# Altium schematic sheet BRD9057A_SiWx917M_4-Layer_ExtSw_REF_DES_A01_Page_3.SchDoc: =TitlePage3
size A3; Organization: Altium Limited; Address1: L3, 12a Rodborough Rd; Address2: Frenchs Forest; Address3: NSW; Address4: Australia 2086; SheetNumber: 3; SheetTotal: 5
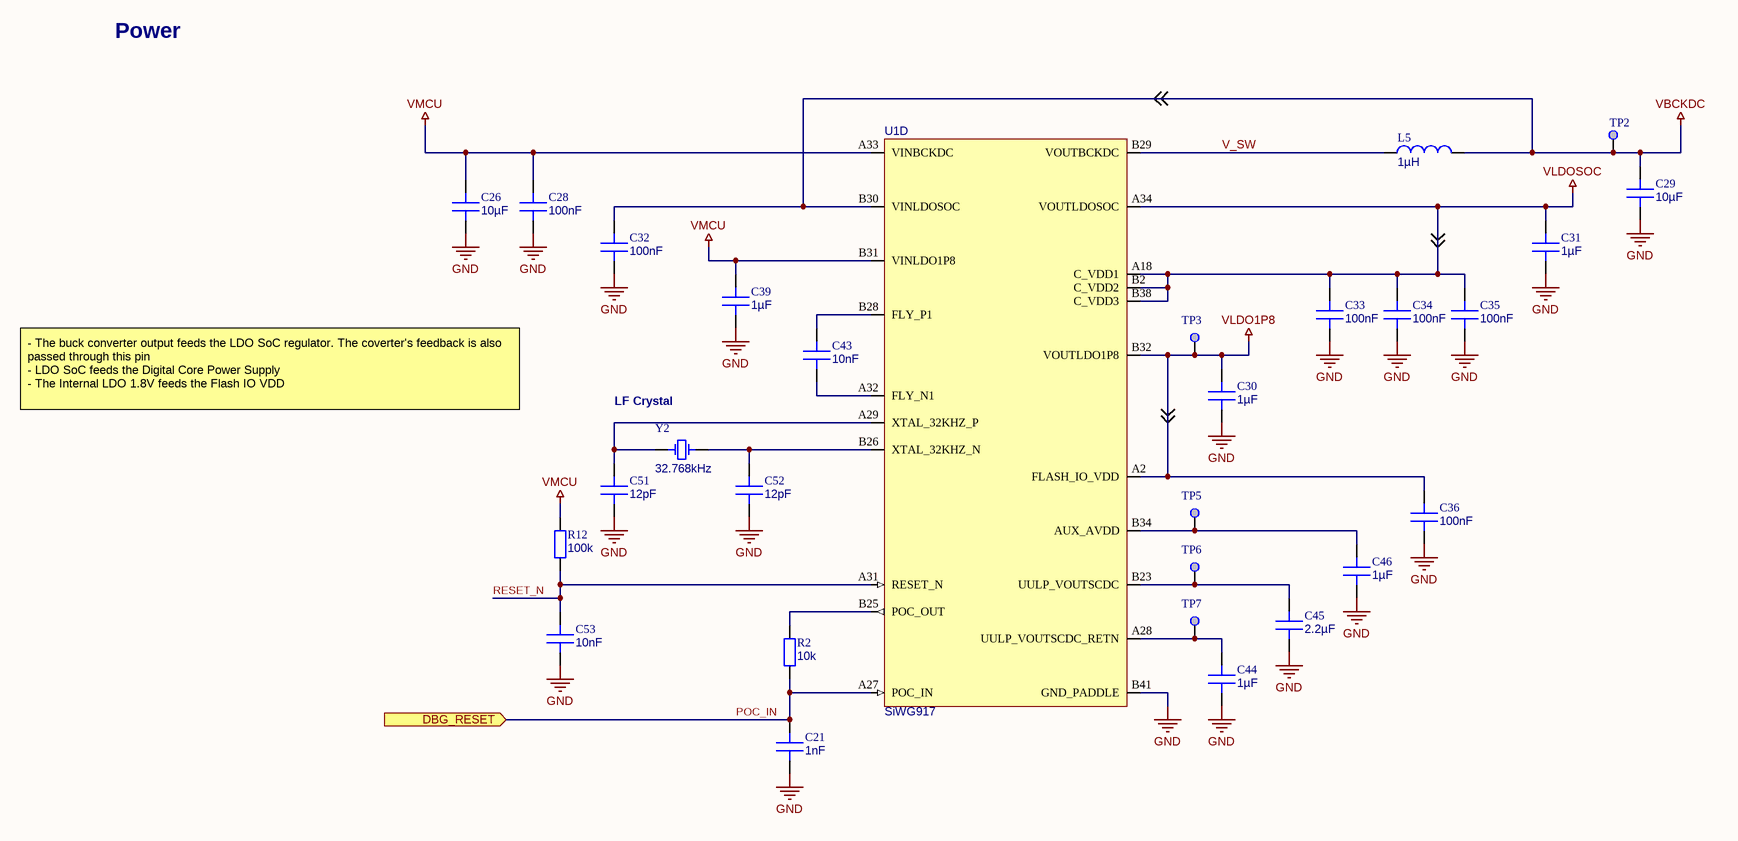
[diagram p0: BRD9057A_SiWx917M_4-Layer_ExtSw_REF_DES_A01_Page_3.SchDoc]

## Parts
C21  value 1nF  [C0201_GM]  (hidden comment: CAP CER 0201 X5R 1nF 16V 10%)
C26  value 10µF  [C0603]  (hidden comment: CAP CER 0603 X5R 10uF 16V 10%)
C28  value 100nF  [C0201_GM]  (hidden comment: CAP CER 0201 X5R 100nF 16V 10%)
C29  value 10µF  [C0603]  (hidden comment: CAP CER 0603 X5R 10uF 16V 10%)
C30  value 1µF  [C0201_GM]  (hidden comment: CAP CER 0201 X5R 1uF 16V 20%)
C31  value 1µF  [C0201_GM]  (hidden comment: CAP CER 0201 X5R 1uF 16V 20%)
C32  value 100nF  [C0201_GM]  (hidden comment: CAP CER 0201 X5R 100nF 16V 10%)
C33  value 100nF  [C0201_GM]  (hidden comment: CAP CER 0201 X5R 100nF 16V 10%)
C34  value 100nF  [C0201_GM]  (hidden comment: CAP CER 0201 X5R 100nF 16V 10%)
C35  value 100nF  [C0201_GM]  (hidden comment: CAP CER 0201 X5R 100nF 16V 10%)
C36  value 100nF  [C0201_GM]  (hidden comment: CAP CER 0201 X5R 100nF 16V 10%)
C39  value 1µF  [C0201_GM]  (hidden comment: CAP CER 0201 X5R 1uF 16V 20%)
C43  value 10nF  [C0201_GM]  (hidden comment: CAP CER 0201 X5R 10nF 16V 10%)
C44  value 1µF  [C0201_GM]  (hidden comment: CAP CER 0201 X5R 1uF 16V 20%)
C45  value 2.2µF  [C0201_GM]  (hidden comment: CAP CER 0201 X5R 2.2uF 10V 20%)
C46  value 1µF  [C0201_GM]  (hidden comment: CAP CER 0201 X5R 1uF 16V 20%)
C51  value 12pF  [C0201_GM]  (hidden comment: GRM0335C1H120FA01)
C52  value 12pF  [C0201_GM]  (hidden comment: GRM0335C1H120FA01)
C53  value 10nF  [C0201_GM]  (hidden comment: CAP CER 0201 X5R 10nF 16V 10%)
L5  value 1µH  [INDC2012X100N_DFE]  (hidden comment: DFE201210U-1R0M#)
R2  value 10k  [R0201]  (hidden comment: RES 0201 10K 1/20W 1% 200ppm)
R12  value 100k  [R0201]  (hidden comment: RES 0201 100K 1/20W 1% 200ppm)
TP2  TEST POINT SMD 1MM  [TP_1.0_SMD]  (value not drawn)  (no BOM)
TP3  TEST POINT SMD 1MM  [TP_1.0_SMD]  (value not drawn)  (no BOM)
TP5  TEST POINT SMD 1MM  [TP_1.0_SMD]  (value not drawn)  (no BOM)
TP6  TEST POINT SMD 1MM  [TP_1.0_SMD]  (value not drawn)  (no BOM)
TP7  TEST POINT SMD 1MM  [TP_1.0_SMD]  (value not drawn)  (no BOM)
U1  value SiWG917  [QFN84_SI_SiWx917_A1]  (hidden comment: SiWG917M111MGTBAR)  (part D of 4)
Y2  value 32.768kHz  [XTAL200X120X60-2N]  (hidden comment: CM8V-T1A-32.768KHZ-7PF-20PPM-TA-QC)

## Ports
DBG_RESET (in)

## Nets
GND: C21.1 C26.1 C28.1 C29.1 C30.1 C31.1 C32.1 C33.1 C34.1 C35.1 C36.1 C39.1 C44.1 C45.1 C46.1 C51.1 C52.1 C53.1 U1.B41(GND_PADDLE)
VBCKDC: C29.2 C32.2 L5.2 TP2.1 U1.B30(VINLDOSOC)
VLDO1P8: C30.2 C36.2 TP3.1 U1.A2(FLASH_IO_VDD) U1.B32(VOUTLDO1P8)
VLDOSOC: C31.2 C33.2 C34.2 C35.2 U1.A18(C_VDD1) U1.A34(VOUTLDOSOC) U1.B2(C_VDD2) U1.B38(C_VDD3)
VMCU: C26.2 C28.2 C39.2 R12.2 U1.A33(VINBCKDC) U1.B31(VINLDO1P8)
POC_IN: C21.2 R2.2 U1.A27(POC_IN) ; port DBG_RESET
RESET_N: C53.2 R12.1 U1.A31(RESET_N)
V_SW: L5.1 U1.B29(VOUTBCKDC)
NetC43_1: C43.1 U1.B28(FLY_P1)
NetC43_2: C43.2 U1.A32(FLY_N1)
NetC44_2: C44.2 TP7.1 U1.A28(UULP_VOUTSCDC_RETN)
NetC45_2: C45.2 TP6.1 U1.B23(UULP_VOUTSCDC)
NetC46_2: C46.2 TP5.1 U1.B34(AUX_AVDD)
NetC51_2: C51.2 U1.A29(XTAL_32KHZ_P) Y2.2
NetC52_2: C52.2 U1.B26(XTAL_32KHZ_N) Y2.1
NetR2_1: R2.1 U1.B25(POC_OUT)

## Notes on the sheet
- Power
- - The buck converter output feeds the LDO SoC regulator. The coverter's feedback is also passed through this pin
  - LDO SoC feeds the Digital Core Power Supply
  - The Internal LDO 1.8V feeds the Flash IO VDD
- (near Y2) LF Crystal
- Board name
- Designed
- Approved
- Page Title
- Size
- A3
- Sheet Modified Date
- Board number
- BRD
- Revision
- Sheet
- COPYRIGHT SILICON LABORATORIES INC.
- CONFIDENTIAL - SUBJECT TO TERMS OF USE
- of

## Library data of the parts
C21 = CMP-120-00153-A.02: SubCategory Tag: Ceramic; Max Operating Temp: 85°C; Tolerance: 10%; Mount: SMD; RoHS: Compliant; Material: X5R; Package: 0201; Min Operating Temp: -55°C; Rating: 16V
C26 C29 = CMP-120-00151-A.01: SubCategory Tag: Ceramic; Tolerance: 10%; RoHS: Compliant; Min Operating Temp: -55°C; Material: X5R; Package: 0603; Mount: SMD; Max Operating Temp: 85°C; Rating: 16V
C28 C32-C36 = CMP-120-00007-B.06: SubCategory Tag: Ceramic; Material: X5R; Max Operating Temp: 85°C; Tolerance: 10%; Rating: 16V; Mount: SMD; Package: 0201; RoHS: Compliant; Min Operating Temp: -55°C
C30 C31 C39 C44 C46 = CMP-120-00154-A.04: SubCategory Tag: Ceramic; RoHS: Compliant; Material: X5R; Max Operating Temp: 85°C; Min Operating Temp: -55°C; Rating: 16V; Package: 0201; Mount: SMD; Tolerance: 20%
C43 C53 = CMP-120-00155-A.02: SubCategory Tag: Ceramic; Max Operating Temp: 85°C; Tolerance: 10%; Mount: SMD; RoHS: Compliant; Material: X5R; Package: 0201; Min Operating Temp: -55°C; Rating: 16V
C45 = CMP-120-00156-A.02: SubCategory Tag: Ceramic; Rating: 10V; Material: X5R; Mount: SMD; RoHS: Compliant; Tolerance: 20%; Package: 0201; Min Operating Temp: -55°C; Max Operating Temp: 85°C
C51 C52 = CMP-120-00336-A.01: CAP CER 0201 C0G 12pF 50V 1%; Manufacturer: Murata; SubCategory Tag: Ceramic; Manufacturer PN: GRM0335C1H120FA01; Min Operating Temp: -55°C; Max Operating Temp: 125°C; RoHS: Compliant; Package: 0201; Mount: SMD; Tolerance: 1%; Material: C0G; Rating: 50V
L5 = CMP-155-00035-A.07: IND Fixed 0805 1uH 2A 95mOhm 20%; Manufacturer: Murata; Shielding: Shielded; DC Resistance: 95m; Manufacturer PN: DFE201210U-1R0M#; Package: 0805; Mount: SMD; Tolerance: 20%; Min Operating Temp: -40°C; Rating: 2A; SubCategory Tag: Fixed; Max Operating Temp: 125°C; RoHS: Compliant
R2 = CMP-180-00002-A.10: SubCategory Tag: Thick Film; Rating: 50mW; Min Operating Temp: -55°C; Max Operating Temp: 125°C; Package: 0201; RoHS: Compliant; Mount: SMD; Tolerance: 1%
R12 = CMP-180-00000-A.10: Rating: 50mW; SubCategory Tag: Thick Film; Package: 0201; RoHS: Compliant; Max Operating Temp: 125°C; Tolerance: 1%; Min Operating Temp: -55°C; Mount: SMD
TP2 TP3 TP5-TP7 = CMP-000-00001-A.11: Additional Search Tag: Surface; Mount: N/A; SubCategory Tag: TEST POINT
  TP3 TP5-TP7: Value: 1MM
U1 = CMP-150-00167-C.02: IC SoC 32BIT 8MB FLASH QFN84 2.4GHz Single Band Wi-Fi; Manufacturer: Silicon Labs; Additional Search Tag: SoC Wireless; SubCategory Tag: Embedded; Voltage: 3.63V; Min Operating Temp: -40°C; Max Operating Temp: 85°C; Manufacturer PN: SiWG917M111MGTBAR; RoHS: Compliant; Mount: SMD; Package: QFN84
Y2 = CMP-130-00007-A.02: CRYSTAL 2.0x1.2mm 32.768kHz 7pF 20ppm; Manufacturer: Micro Crystal; SubCategory Tag: XTAL; Manufacturer PN: CM8V-T1A-32.768KHZ-7PF-20PPM-TA-QC; Max Operating Temp: 85°C; RoHS: Compliant; Min Operating Temp: -40°C; Tolerance: 20ppm; Mount: SMD; Package: 2.0x1.2mm